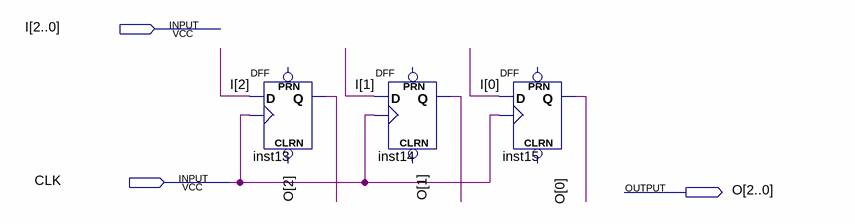
[diagram p0: schematic sheet]
// Quartus schematic Reg1x3.bdf as structural Verilog: 3 symbols, 3 pins
module Reg1x3 (
  input  [2:0] I,
  input  CLK,
  output [2:0] O
);

  DFF inst13 (.CLK(CLK), .D(I[2]), .Q(O[2]));  // open: CLRN, PRN
  DFF inst14 (.CLK(CLK), .D(I[1]), .Q(O[1]));  // open: CLRN, PRN
  DFF inst15 (.CLK(CLK), .D(I[0]), .Q(O[0]));  // open: CLRN, PRN
endmodule
